# Altium schematic sheet Microcontroller.SchDoc
size A4
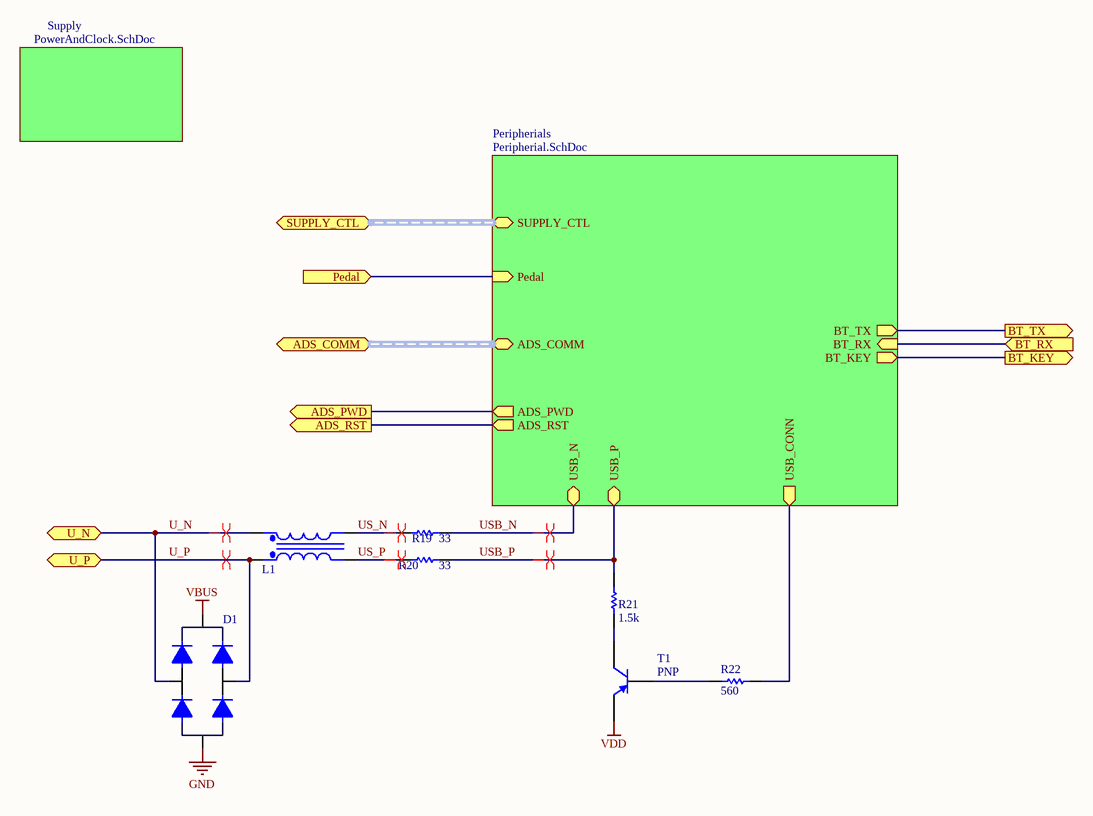
[diagram p0: Microcontroller.SchDoc]

## Parts
D1  ESD Diode  [SOT-143_M]  (value not drawn)
L1  Choke Coil  [1206-4]  (value not drawn)
R19  value 33  [0805]  (hidden comment: Resistor)
R20  value 33  [0805]  (hidden comment: Resistor)
R21  value 1.5k  [0805]  (hidden comment: Resistor)
R22  value 560  [0805]  (hidden comment: Resistor)
T1  PNP  [SOT23]

## Sub-sheets
Peripherials = Peripherial.SchDoc: USB_CONN (out), USB_P (bidir), USB_N (bidir), ADS_RST (out), ADS_PWD (out), BT_TX (out), BT_RX (in), BT_KEY (out), Pedal (in), ADS_COMM (harness SPI), SUPPLY_CTL (harness Supply)
Supply = PowerAndClock.SchDoc: no entries

## Ports
ADS_COMM (harness SPI), ADS_PWD (out), ADS_RST (out), BT_KEY (out), BT_RX (in), BT_TX (out), Pedal (in), SUPPLY_CTL (harness SUPPLY), U_N (bidir), U_P (bidir)

## Nets
GND: D1.1
VBUS: D1.4
VDD: T1.3(E)
ADS_PWD: port ADS_PWD, sheet Peripherials/ADS_PWD
ADS_RST: port ADS_RST, sheet Peripherials/ADS_RST
BT_KEY: port BT_KEY, sheet Peripherials/BT_KEY
BT_RX: port BT_RX, sheet Peripherials/BT_RX
BT_TX: port BT_TX, sheet Peripherials/BT_TX
Pedal: port Pedal, sheet Peripherials/Pedal
U_N: D1.3 L1.4(Sec-) ; port U_N
U_P: D1.2 L1.1(Pri+) ; port U_P
US_N: L1.3(Sec+) R19.1
US_P: L1.2(Pri-) R20.1
USB_N: R19.2 ; sheet Peripherials/USB_N
USB_P: R20.2 R21.2 ; sheet Peripherials/USB_P
NetR21_1: R21.1 T1.1(C)
NetR22_1: R22.1 T1.2(B)
NetR22_2: R22.2 ; sheet Peripherials/USB_CONN

## Buses and harness runs
harness port ADS_COMM = sheet Peripherials/ADS_COMM
harness port SUPPLY_CTL = sheet Peripherials/SUPPLY_CTL

## Layout directives
differential pair: U_N, U_P, US_N, US_P, USB_N, USB_P

## Library data of the parts
D1 = ESD Diode: ESD Protection